# EAGLE design osso (EAGLE 6.5.0)
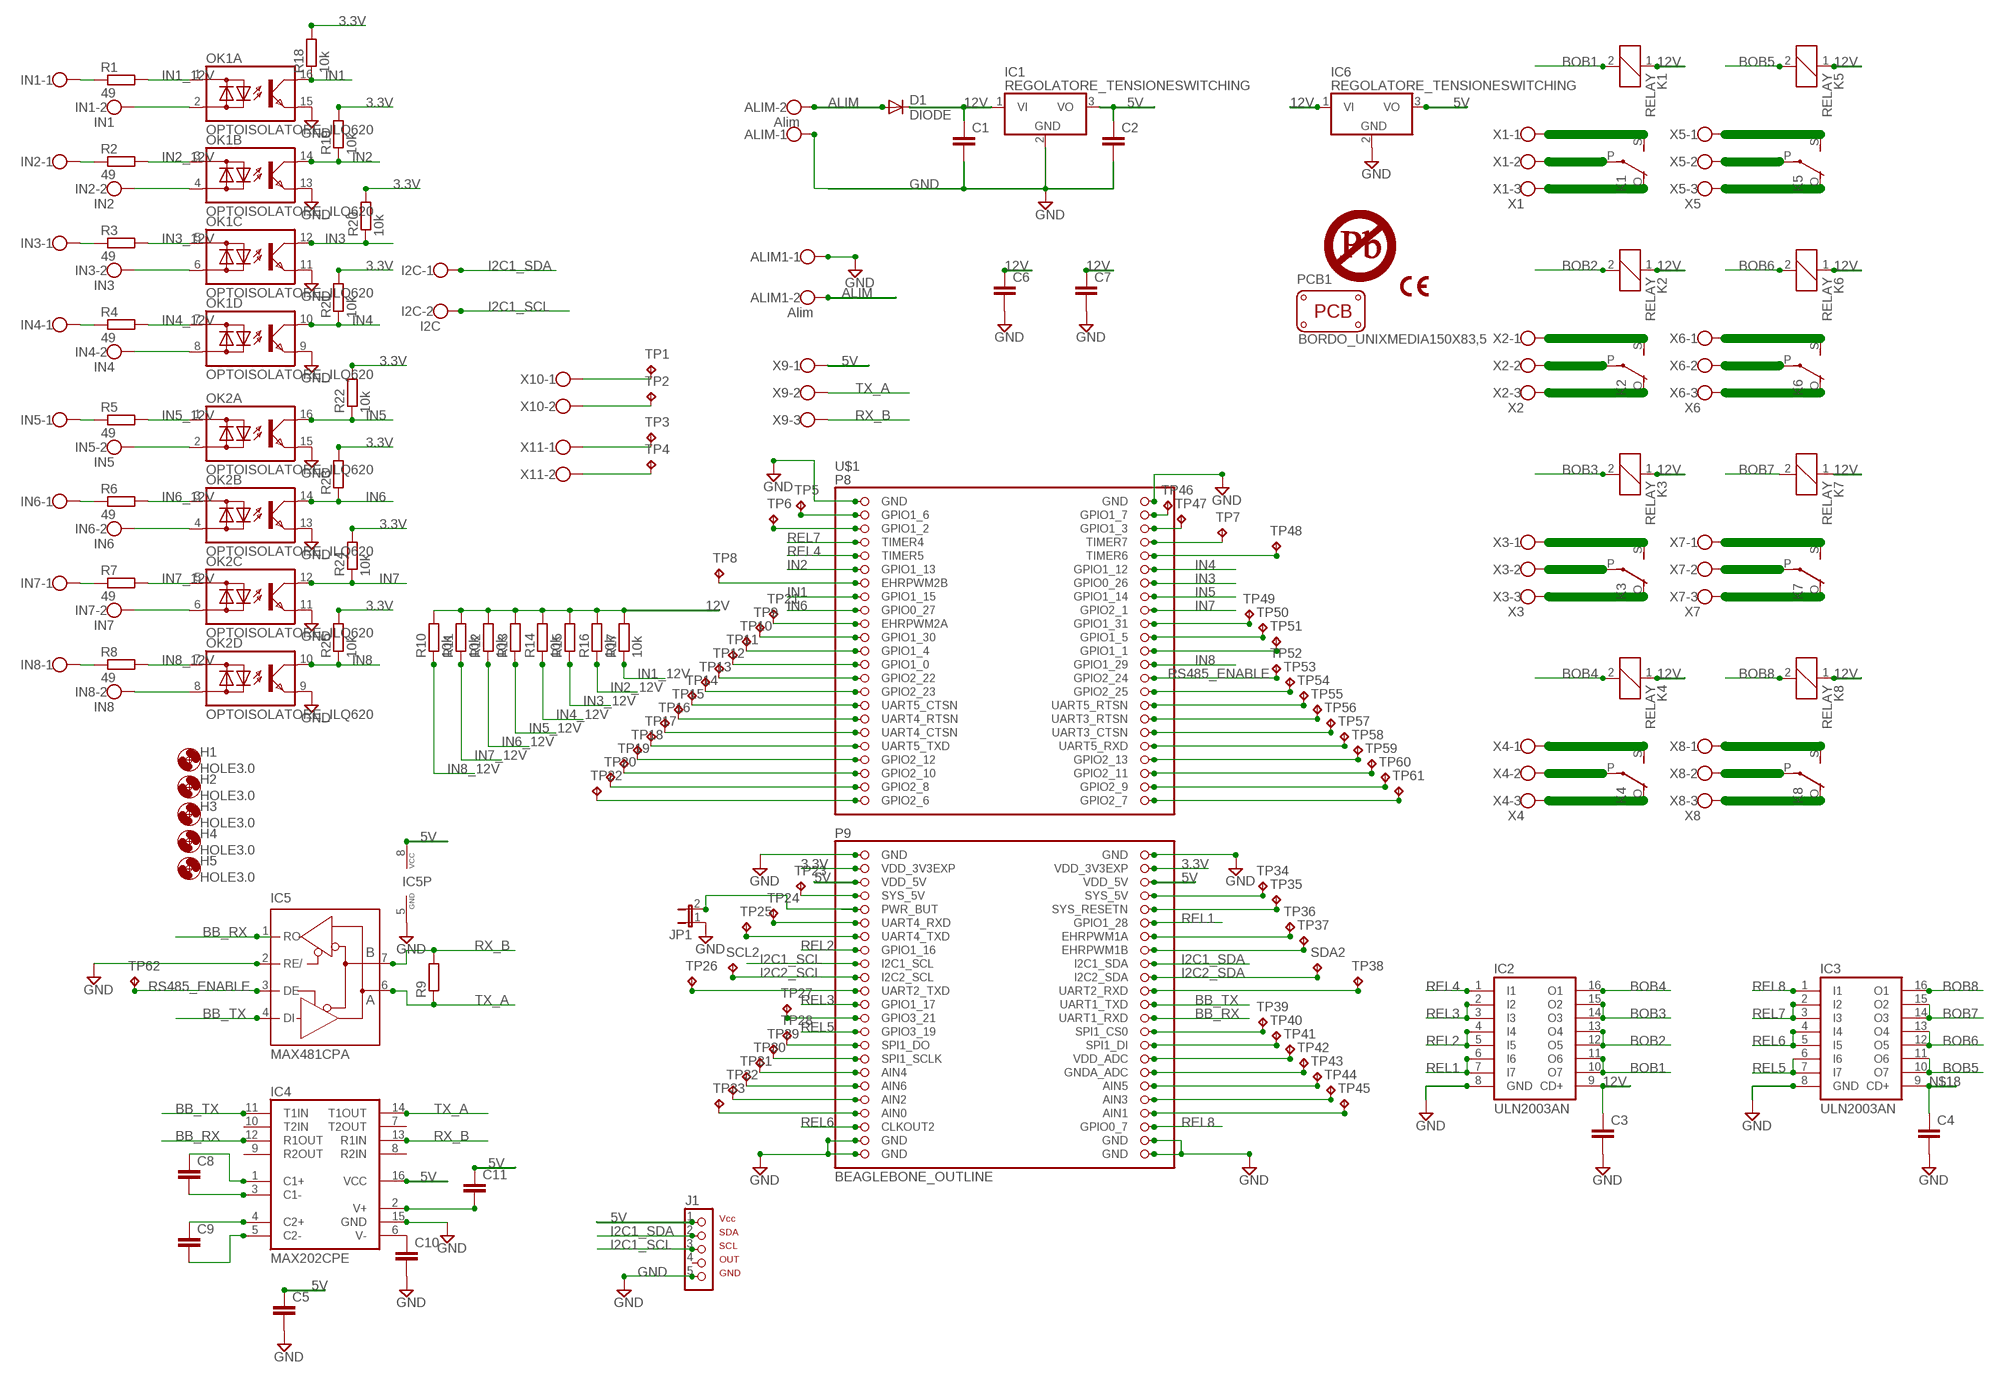
[diagram p0: schematic, sheet 1]

## Parts
ALIM  Alim  MORSETTO_2  [W237-102]
ALIM1  Alim  MORSETTO_2  [W237-102]
C1  C5/2.5  [C5B2.5]
C2  C5/2.5  [C5B2.5]
C3  C5/2.5  [C5B2.5]
C4  C5/2.5  [C5B2.5]
C5  C5/2.5  [C5B2.5]
C6  C5/2.5  [C5B2.5]
C7  C5/2.5  [C5B2.5]
C8  C5/2.5  [C5B2.5]
C9  C5/2.5  [C5B2.5]
C10  C5/2.5  [C5B2.5]
C11  C5/2.5  [C5B2.5]
D1  DIODE  [DO15-12]
H1  HOLE3.0  [3,0]
H2  HOLE3.0  [3,0]
H3  HOLE3.0  [3,0]
H4  HOLE3.0  [3,0]
H5  HOLE3.0  [3,0]
I2C  I2C  MORSETTO_2  [W237-102]
IC1  REGOLATORE_TENSIONESWITCHING  [MT6-3]
IC2  ULN2003AN  [DIL16]
IC3  ULN2003AN  [DIL16]
IC4  MAX202CPE  [DIL16]
IC5  MAX481CPA  [DIL08]
IC6  REGOLATORE_TENSIONESWITCHING  [MT6-3]
IN1  IN1  MORSETTO_2  [W237-102]
IN2  IN2  MORSETTO_2  [W237-102]
IN3  IN3  MORSETTO_2  [W237-102]
IN4  IN4  MORSETTO_2  [W237-102]
IN5  IN5  MORSETTO_2  [W237-102]
IN6  IN6  MORSETTO_2  [W237-102]
IN7  IN7  MORSETTO_2  [W237-102]
IN8  IN8  MORSETTO_2  [W237-102]
J1  RTC_MICROROBOT_ALGOZINO-PTH  [RTC_MICROBOT_ALGOZINO]
JP1  JUMPER_2  [JP1]
K1  RELAY  [G5LE]
K2  RELAY  [G5LE]
K3  RELAY  [G5LE]
K4  RELAY  [G5LE]
K5  RELAY  [G5LE]
K6  RELAY  [G5LE]
K7  RELAY  [G5LE]
K8  RELAY  [G5LE]
OK1  OPTOISOLATORE_ILQ620  [DIL16]
OK2  OPTOISOLATORE_ILQ620  [DIL16]
PCB1  BORDO_UNIXMEDIA150X83,5  [BORD_UNIXMEDIA]
R1  49  RESISTOR0204/7  [0204/7]
R2  49  RESISTOR0204/7  [0204/7]
R3  49  RESISTOR0204/7  [0204/7]
R4  49  RESISTOR0204/7  [0204/7]
R5  49  RESISTOR0204/7  [0204/7]
R6  49  RESISTOR0204/7  [0204/7]
R7  49  RESISTOR0204/7  [0204/7]
R8  49  RESISTOR0204/7  [0204/7]
R9  RESISTOR0204/7  [0204/7]
R10  10k  RESISTOR0204/7  [0204/7]
R11  10k  RESISTOR0204/7  [0204/7]
R12  10k  RESISTOR0204/7  [0204/7]
R13  RESISTOR0204/7  [0204/7]
R14  10k  RESISTOR0204/7  [0204/7]
R15  RESISTOR0204/7  [0204/7]
R16  10k  RESISTOR0204/7  [0204/7]
R17  10k  RESISTOR0204/7  [0204/7]
R18  10k  RESISTOR0204/7  [0204/7]
R19  10k  RESISTOR0204/7  [0204/7]
R20  10k  RESISTOR0204/7  [0204/7]
R21  10k  RESISTOR0204/7  [0204/7]
R22  10k  RESISTOR0204/7  [0204/7]
R23  RESISTOR0204/7  [0204/7]
R24  10k  RESISTOR0204/7  [0204/7]
R25  10k  RESISTOR0204/7  [0204/7]
SCL2  TPPAD1-13  [TEST_POINT]
SDA2  TP1  TPPAD1-13  [TEST_POINT]
SS1  CE-MARK  [CE-MARK-0.2]
SS2  PB-MARK  [PB-MARK-0.2]
TP1  TPPAD1-13  [TEST_POINT]
TP2  TPPAD1-13  [TEST_POINT]
TP3  TPPAD1-13  [TEST_POINT]
TP4  TPPAD1-13  [TEST_POINT]
TP5  TPPAD1-13  [TEST_POINT]
TP6  TPPAD1-13  [TEST_POINT]
TP7  TPPAD1-13  [TEST_POINT]
TP8  TPPAD1-13  [TEST_POINT]
TP9  TPPAD1-13  [TEST_POINT]
TP10  TPPAD1-13  [TEST_POINT]
TP11  TPPAD1-13  [TEST_POINT]
TP12  TPPAD1-13  [TEST_POINT]
TP13  TPPAD1-13  [TEST_POINT]
TP14  TPPAD1-13  [TEST_POINT]
TP15  TPPAD1-13  [TEST_POINT]
TP16  TPPAD1-13  [TEST_POINT]
TP17  TPPAD1-13  [TEST_POINT]
TP18  TPPAD1-13  [TEST_POINT]
TP19  TPPAD1-13  [TEST_POINT]
TP20  TPPAD1-13  [TEST_POINT]
TP21  TPPAD1-13  [TEST_POINT]
TP22  TPPAD1-13  [TEST_POINT]
TP23  TPPAD1-13  [TEST_POINT]
TP24  TPPAD1-13  [TEST_POINT]
TP25  TPPAD1-13  [TEST_POINT]
TP26  TPPAD1-13  [TEST_POINT]
TP27  TPPAD1-13  [TEST_POINT]
TP28  TPPAD1-13  [TEST_POINT]
TP29  TPPAD1-13  [TEST_POINT]
TP30  TPPAD1-13  [TEST_POINT]
TP31  TPPAD1-13  [TEST_POINT]
TP32  TPPAD1-13  [TEST_POINT]
TP33  TPPAD1-13  [TEST_POINT]
TP34  TPPAD1-13  [TEST_POINT]
TP35  TPPAD1-13  [TEST_POINT]
TP36  TPPAD1-13  [TEST_POINT]
TP37  TPPAD1-13  [TEST_POINT]
TP38  TPPAD1-13  [TEST_POINT]
TP39  TPPAD1-13  [TEST_POINT]
TP40  TPPAD1-13  [TEST_POINT]
TP41  TPPAD1-13  [TEST_POINT]
TP42  TPPAD1-13  [TEST_POINT]
TP43  TPPAD1-13  [TEST_POINT]
TP44  TPPAD1-13  [TEST_POINT]
TP45  TPPAD1-13  [TEST_POINT]
TP46  TPPAD1-13  [TEST_POINT]
TP47  TPPAD1-13  [TEST_POINT]
TP48  TPPAD1-13  [TEST_POINT]
TP49  TPPAD1-13  [TEST_POINT]
TP50  TPPAD1-13  [TEST_POINT]
TP51  TPPAD1-13  [TEST_POINT]
TP52  TPPAD1-13  [TEST_POINT]
TP53  TPPAD1-13  [TEST_POINT]
TP54  TPPAD1-13  [TEST_POINT]
TP55  TPPAD1-13  [TEST_POINT]
TP56  TPPAD1-13  [TEST_POINT]
TP57  TPPAD1-13  [TEST_POINT]
TP58  TPPAD1-13  [TEST_POINT]
TP59  TPPAD1-13  [TEST_POINT]
TP60  TPPAD1-13  [TEST_POINT]
TP61  TPPAD1-13  [TEST_POINT]
TP62  TPPAD1-13  [TEST_POINT]
U$1  BEAGLEBONE_OUTLINE  [BEAGLEBONE_SHIELD]
X1  X1  MORSETTO_3  [W237-103]
X2  X2  MORSETTO_3  [W237-103]
X3  X3  MORSETTO_3  [W237-103]
X4  X4  MORSETTO_3  [W237-103]
X5  X5  MORSETTO_3  [W237-103]
X6  X6  MORSETTO_3  [W237-103]
X7  X7  MORSETTO_3  [W237-103]
X8  X8  MORSETTO_3  [W237-103]
X9  MORSETTO_3  [W237-103]
X10  MORSETTO_2  [W237-102]
X11  MORSETTO_2  [W237-102]

## Nets
3.3V: R18.2 R19.2 R20.2 R21.2 R22.2 R23.2 R24.2 R25.2 U$1.49(VDD_3V3EXP) U$1.50(VDD_3V3EXP)
5V: C2.1 C5.1 C11.1 IC1.3(VO) IC4.16(VCC) IC5.8(VCC) IC6.3(VO) J1.1 U$1.51(VDD_5V) U$1.52(VDD_5V) X9.1
12V: C1.1 C3.1 C6.1 C7.1 D1.C IC1.1(VI) IC2.9(CD+) IC6.1(VI) K1.1 K2.1 K3.1 K4.1 K5.1 K6.1 K7.1 K8.1 R10.2 R11.2 R12.2 R13.2 R14.2 R15.2 R16.2 R17.2
ALIM: ALIM1.2 ALIM.2 D1.A
BB_RX: IC4.12(R1OUT) IC5.1(RO) U$1.72(UART1_RXD)
BB_TX: IC4.11(T1IN) IC5.4(DI) U$1.70(UART1_TXD)
BOB1: IC2.10(O7) IC2.11(O6) K1.2
BOB2: IC2.12(O5) IC2.13(O4) K2.2
BOB3: IC2.14(O3) IC2.15(O2) K3.2
BOB4: IC2.16(O1) K4.2
BOB5: IC3.10(O7) IC3.11(O6) K5.2
BOB6: IC3.12(O5) IC3.13(O4) K6.2
BOB7 [pista15]: IC3.14(O3) IC3.15(O2) K7.2
BOB8: IC3.16(O1) K8.2
GND: ALIM1.1 ALIM.1 C1.2 C2.2 C3.2 C4.2 C5.2 C6.2 C7.2 C10.2 IC1.2(GND) IC2.8(GND) IC3.8(GND) IC4.15(GND) IC5.2(RE/) IC5.5(GND) IC6.2(GND) J1.5 JP1.1 OK1.9(D:E) OK1.11(C:E) OK1.13(B:E) OK1.15(A:E) OK2.9(D:E) OK2.11(C:E) OK2.13(B:E) OK2.15(A:E) U$1.1(GND) U$1.2(GND) U$1.47(GND) U$1.48(GND) U$1.89(GND) U$1.90(GND) U$1.91(GND) U$1.92(GND)
I2C1_SCL: I2C.2 J1.3 U$1.63(I2C1_SCL)
I2C1_SDA: I2C.1 J1.2 U$1.64(I2C1_SDA)
I2C2_SCL: SCL2.TP U$1.65(I2C2_SCL)
I2C2_SDA: SDA2.TP U$1.66(I2C2_SDA)
IN1: OK1.16(A:C) R18.1 U$1.15(GPIO1_15)
IN1_12V: OK1.1(A:AC1) R1.2 R17.1
IN2: OK1.14(B:C) R19.1 U$1.11(GPIO1_13)
IN2_12V: OK1.3(B:AC1) R2.2 R16.1
IN3: OK1.12(C:C) R20.1 U$1.14(GPIO0_26)
IN3_12V: OK1.5(C:AC1) R3.2 R15.1
IN4: OK1.10(D:C) R21.1 U$1.12(GPIO1_12)
IN4_12V: OK1.7(D:AC1) R4.2 R14.1
IN5: OK2.16(A:C) R22.1 U$1.16(GPIO1_14)
IN5_12V: OK2.1(A:AC1) R5.2 R13.1
IN6: OK2.14(B:C) R23.1 U$1.17(GPIO0_27)
IN6_12V: OK2.3(B:AC1) R6.2 R12.1
IN7: OK2.12(C:C) R24.1 U$1.18(GPIO2_1)
IN7_12V: OK2.5(C:AC1) R7.2 R11.1
IN8: OK2.10(D:C) R25.1 U$1.26(GPIO1_29)
IN8_12V: OK2.7(D:AC1) R8.2 R10.1
N$1: IN1.1 R1.1
N$2: TP1.TP X10.1
N$6 [rele]: K5.S(2:S) X5.1
N$7 [rele]: K5.P(2:P) X5.2
N$8 [rele]: K5.O(2:O) X5.3
N$12 [rele]: K6.S(2:S) X6.1
N$13 [rele]: K6.P(2:P) X6.2
N$14 [rele]: K6.O(2:O) X6.3
N$15 [rele]: K3.S(2:S) X3.1
N$16 [rele]: K3.P(2:P) X3.2
N$17 [rele]: K3.O(2:O) X3.3
N$18: C4.1 IC3.9(CD+)
N$19 [rele]: K7.S(2:S) X7.1
N$20 [rele]: K7.P(2:P) X7.2
N$21 [rele]: K4.S(2:S) X4.1
N$22 [rele]: K4.P(2:P) X4.2
N$23 [rele]: K4.O(2:O) X4.3
N$24 [rele]: K8.S(2:S) X8.1
N$25 [rele]: K8.P(2:P) X8.2
N$26 [rele]: K8.O(2:O) X8.3
N$27: IN2.1 R2.1
N$28: TP2.TP X10.2
N$29: IN3.1 R3.1
N$30: TP3.TP X11.1
N$31: IN4.1 R4.1
N$32: TP4.TP X11.2
N$33: IN5.1 R5.1
N$34: TP7.TP U$1.8(TIMER7)
N$35: IN6.1 R6.1
N$36: TP22.TP U$1.45(GPIO2_6)
N$37: IN7.1 R7.1
N$38: TP20.TP U$1.43(GPIO2_8)
N$39: IN8.1 R8.1
N$40: TP19.TP U$1.41(GPIO2_10)
N$41: IN8.2 OK2.8(D:AC2)
N$42: IN7.2 OK2.6(C:AC2)
N$43: IN6.2 OK2.4(B:AC2)
N$44: IN5.2 OK2.2(A:AC2)
N$45: IN1.2 OK1.2(A:AC2)
N$46: IN2.2 OK1.4(B:AC2)
N$47: IN3.2 OK1.6(C:AC2)
N$48: IN4.2 OK1.8(D:AC2)
N$49: JP1.2 U$1.55(PWR_BUT)
N$50: TP18.TP U$1.39(GPIO2_12)
N$51: TP17.TP U$1.37(UART5_TXD)
N$52: TP16.TP U$1.35(UART4_CTSN)
N$53: TP15.TP U$1.33(UART4_RTSN)
N$54: TP14.TP U$1.31(UART5_CTSN)
N$55: TP13.TP U$1.29(GPIO2_23)
N$56: TP12.TP U$1.27(GPIO2_22)
N$57: TP11.TP U$1.25(GPIO1_0)
N$58: TP10.TP U$1.23(GPIO1_4)
N$59: TP9.TP U$1.21(GPIO1_30)
N$60: TP21.TP U$1.19(EHRPWM2A)
N$61: TP5.TP U$1.3(GPIO1_6)
N$62: TP6.TP U$1.5(GPIO1_2)
N$63 [rele]: K7.O(2:O) X7.3
N$64: TP8.TP U$1.13(EHRPWM2B)
N$65: TP33.TP U$1.85(AIN0)
N$66: TP32.TP U$1.83(AIN2)
N$67: TP31.TP U$1.81(AIN6)
N$68: TP30.TP U$1.79(AIN4)
N$69: TP29.TP U$1.77(SPI1_SCLK)
N$70: TP28.TP U$1.75(SPI1_DO)
N$71: TP27.TP U$1.71(GPIO3_21)
N$72: TP26.TP U$1.67(UART2_TXD)
N$73: TP25.TP U$1.59(UART4_TXD)
N$74: TP24.TP U$1.57(UART4_RXD)
N$75: TP23.TP U$1.53(SYS_5V)
N$76: TP34.TP U$1.54(SYS_5V)
N$77: TP35.TP U$1.56(SYS_RESETN)
N$78: TP36.TP U$1.60(EHRPWM1A)
N$79: TP37.TP U$1.62(EHRPWM1B)
N$80: TP38.TP U$1.68(UART2_RXD)
N$81: TP39.TP U$1.74(SPI1_CS0)
N$82: TP40.TP U$1.76(SPI1_DI)
N$83: TP41.TP U$1.78(VDD_ADC)
N$84: TP42.TP U$1.80(GNDA_ADC)
N$85: TP43.TP U$1.82(AIN5)
N$86: TP44.TP U$1.84(AIN3)
N$87: TP45.TP U$1.86(AIN1)
N$88: TP61.TP U$1.46(GPIO2_7)
N$89: TP60.TP U$1.44(GPIO2_9)
N$90: TP59.TP U$1.42(GPIO2_11)
N$91: TP58.TP U$1.40(GPIO2_13)
N$92: TP57.TP U$1.38(UART5_RXD)
N$93: TP56.TP U$1.36(UART3_CTSN)
N$94: TP55.TP U$1.34(UART3_RTSN)
N$95: TP54.TP U$1.32(UART5_RTSN)
N$96: TP53.TP U$1.30(GPIO2_25)
N$98: TP51.TP U$1.24(GPIO1_1)
N$99: TP50.TP U$1.22(GPIO1_5)
N$100: TP49.TP U$1.20(GPIO1_31)
N$101: TP48.TP U$1.10(TIMER6)
N$102: TP47.TP U$1.6(GPIO1_3)
N$103: TP46.TP U$1.4(GPIO1_7)
N$105: C8.1 IC4.1(C1+)
N$106: C8.2 IC4.3(C1-)
N$107: C9.1 IC4.4(C2+)
N$108: C9.2 IC4.5(C2-)
R1_C [rele]: K1.P(2:P) X1.2
R1_NA [rele]: K1.S(2:S) X1.1
R1_NC [rele]: K1.O(2:O) X1.3
R2_C [rele]: K2.P(2:P) X2.2
R2_NA [rele]: K2.S(2:S) X2.1
R2_NC [rele]: K2.O(2:O) X2.3
REL1: IC2.6(I6) IC2.7(I7) U$1.58(GPIO1_28)
REL2: IC2.4(I4) IC2.5(I5) U$1.61(GPIO1_16)
REL3: IC2.2(I2) IC2.3(I3) U$1.69(GPIO1_17)
REL4: IC2.1(I1) U$1.9(TIMER5)
REL5: IC3.6(I6) IC3.7(I7) U$1.73(GPIO3_19)
REL6: IC3.4(I4) IC3.5(I5) U$1.87(CLKOUT2)
REL7: IC3.2(I2) IC3.3(I3) U$1.7(TIMER4)
REL8: IC3.1(I1) U$1.88(GPIO0_7)
RS485_ENABLE: IC5.3(DE) TP52.TP TP62.TP U$1.28(GPIO2_24)
RX_B: IC4.13(R1IN) IC5.7(B) R9.2 X9.3
TX_A: IC4.14(T1OUT) IC5.6(A) R9.1 X9.2
V+: C11.2 IC4.2(V+)
V-: C10.1 IC4.6(V-)
Unconnected: IC4.7(T2OUT) IC4.8(R2IN) IC4.9(R2OUT) IC4.10(T2IN) J1.4

## Library data of the parts
ALIM ALIM1 I2C IN1-IN8 X10 X11 = 0_My_Library:MORSETTO_2: WAGO SCREW CLAMP; MPN: 237-102; OC_FARNELL: unknown; OC_NEWARK: 70K9898
C1-C11 = My_Library:C: CAPACITOR naming: grid - package width
D1 = My_Library:DIODE: DIODE controlled avalanche rectifier
H1-H5 = 0_My_Library:HOLE: MOUNTING HOLE with drill center marker
IC1 IC6 = My_Library:REGOLATORE_TENSIONE: Positive VOLTAGE REGULATOR Source: http://cache.national.com/ds/LM/LM78L05.pdf http://www.fairchildsemi.com/ds/LM/LM7805.pdf
IC2 IC3 = My_Library:ULN2003A: DRIVER ARRAY
IC4 = maxim:MAX202CPE: RS232 TRANSEIVER; MF: MAXIM; MPN: MAX202CPE+; OC_FARNELL: 9723803; OC_NEWARK: 68K4531
IC5 = maxim:MAX481CPA: RS485 TRANSEIVER; MPN: MAX481CPA+; OC_FARNELL: unknown; OC_NEWARK: 99K3445
J1 = 0_My_Library:RTC_MICROROBOT_ALGOZINO
JP1 = 0_My_Library:JUMPER_2: JUMPER
K1-K6 K8 = My_Library:RELAY: RELAY 1 x switch, 10 A/120 V AC, 8 A/30 V ADC, Omron; OC_FARNELL: unknown; OC_NEWARK: unknown
K7 = 0_My_Library:RELAY: RELAY 1 x switch, 10 A/120 V AC, 8 A/30 V ADC, Omron; OC_FARNELL: unknown; OC_NEWARK: unknown
OK1 OK2 = 0_My_Library:OPTOISOLATORE_ILQ620: SIEMENS OPTO COUPLER; MF: VISHAY/TELEFUNKEN; MPN: ILQ620; OC_FARNELL: 1612470; OC_NEWARK: 58K1694
PCB1 = 0_My_Library:BORDO_UNIXMEDIA: Dangerous Prototypes Standard Rectangular PCB sizes
R1-R25 = 0_My_Library:RESISTOR: RESISTOR, European symbol
SCL2 SDA2 TP1-TP62 = 0_My_Library:TP: Test pad
SS1 = 0_My_Library:CE-MARK
SS2 = 0_My_Library:PB-MARK
U$1 = adafruit:BEAGLEBONE_OUTLINE: Should match A3 pinout - but not completely tested
X1-X9 = 0_My_Library:MORSETTO_3: WAGO SCREW CLAMP; MPN: 237-103; OC_FARNELL: unknown; OC_NEWARK: 18M7116

## Net classes
0 default: width 0.254 mm
1 rele: width 1.676 mm
2 pista15: width 0.381 mm

## Board
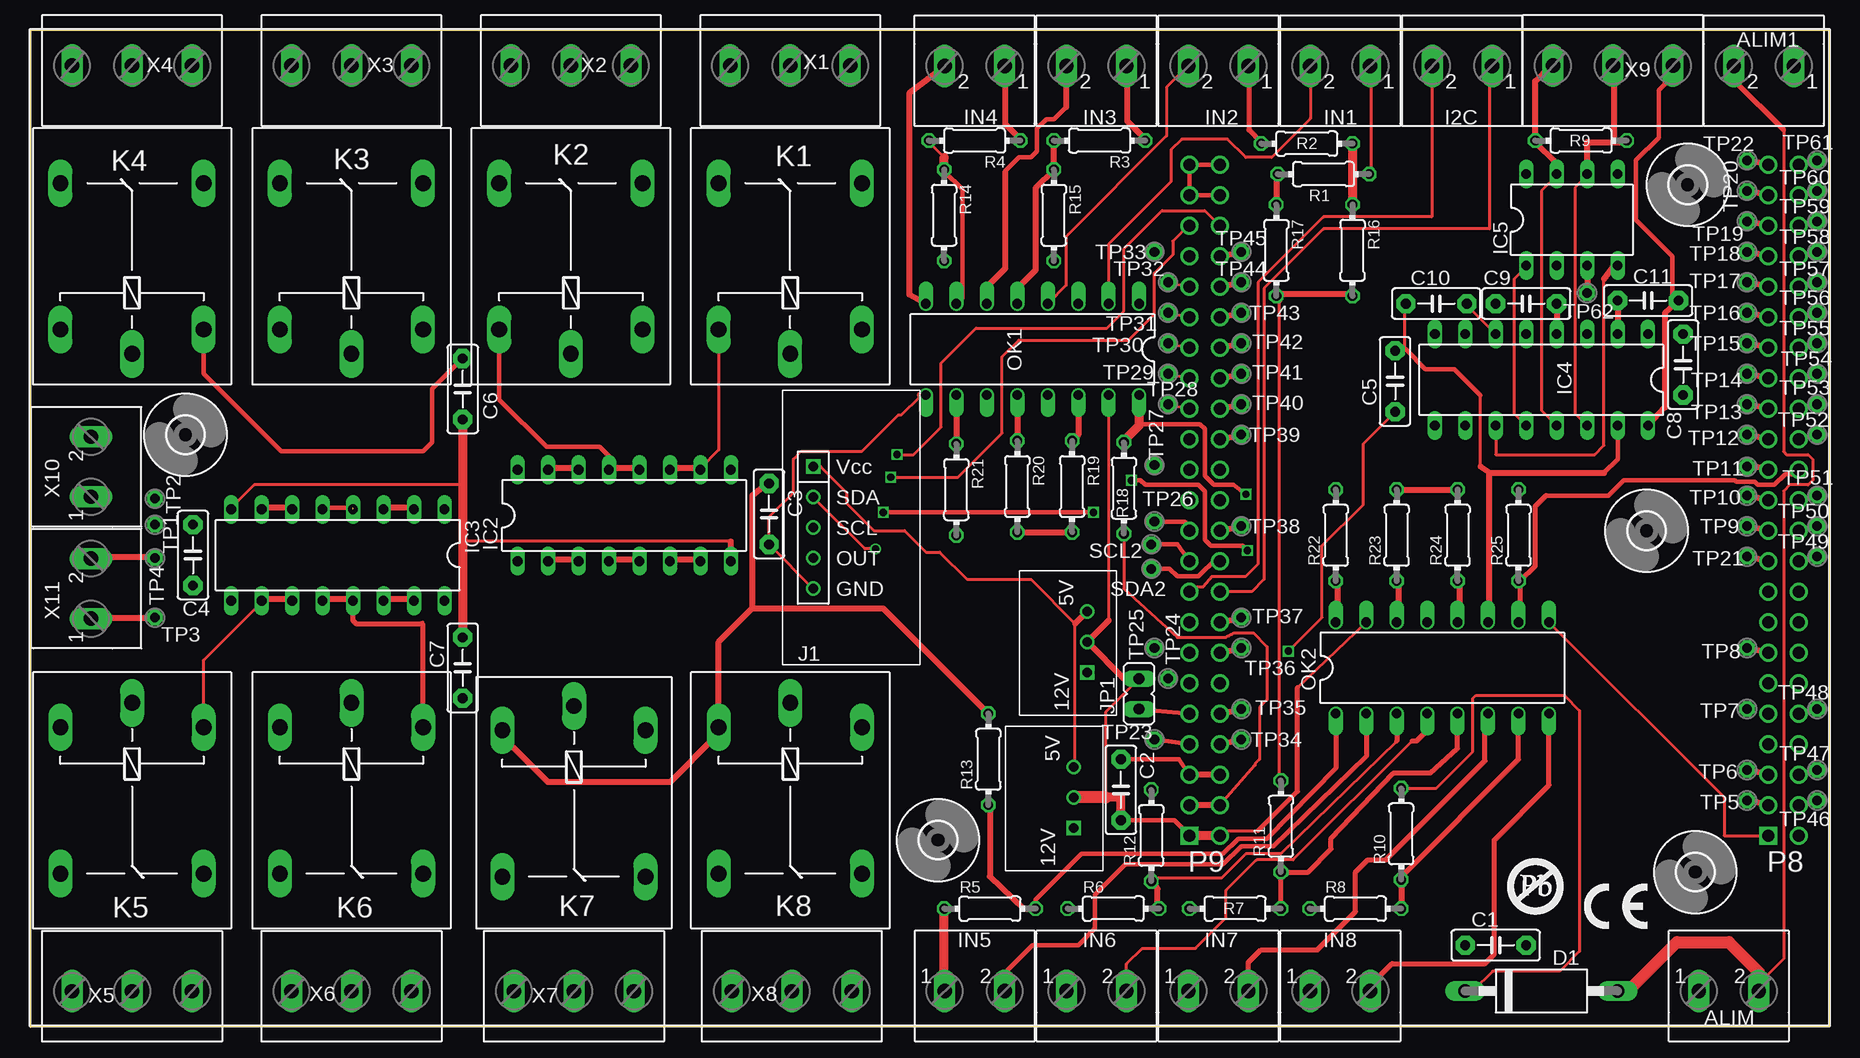
[diagram p1: board, top side]
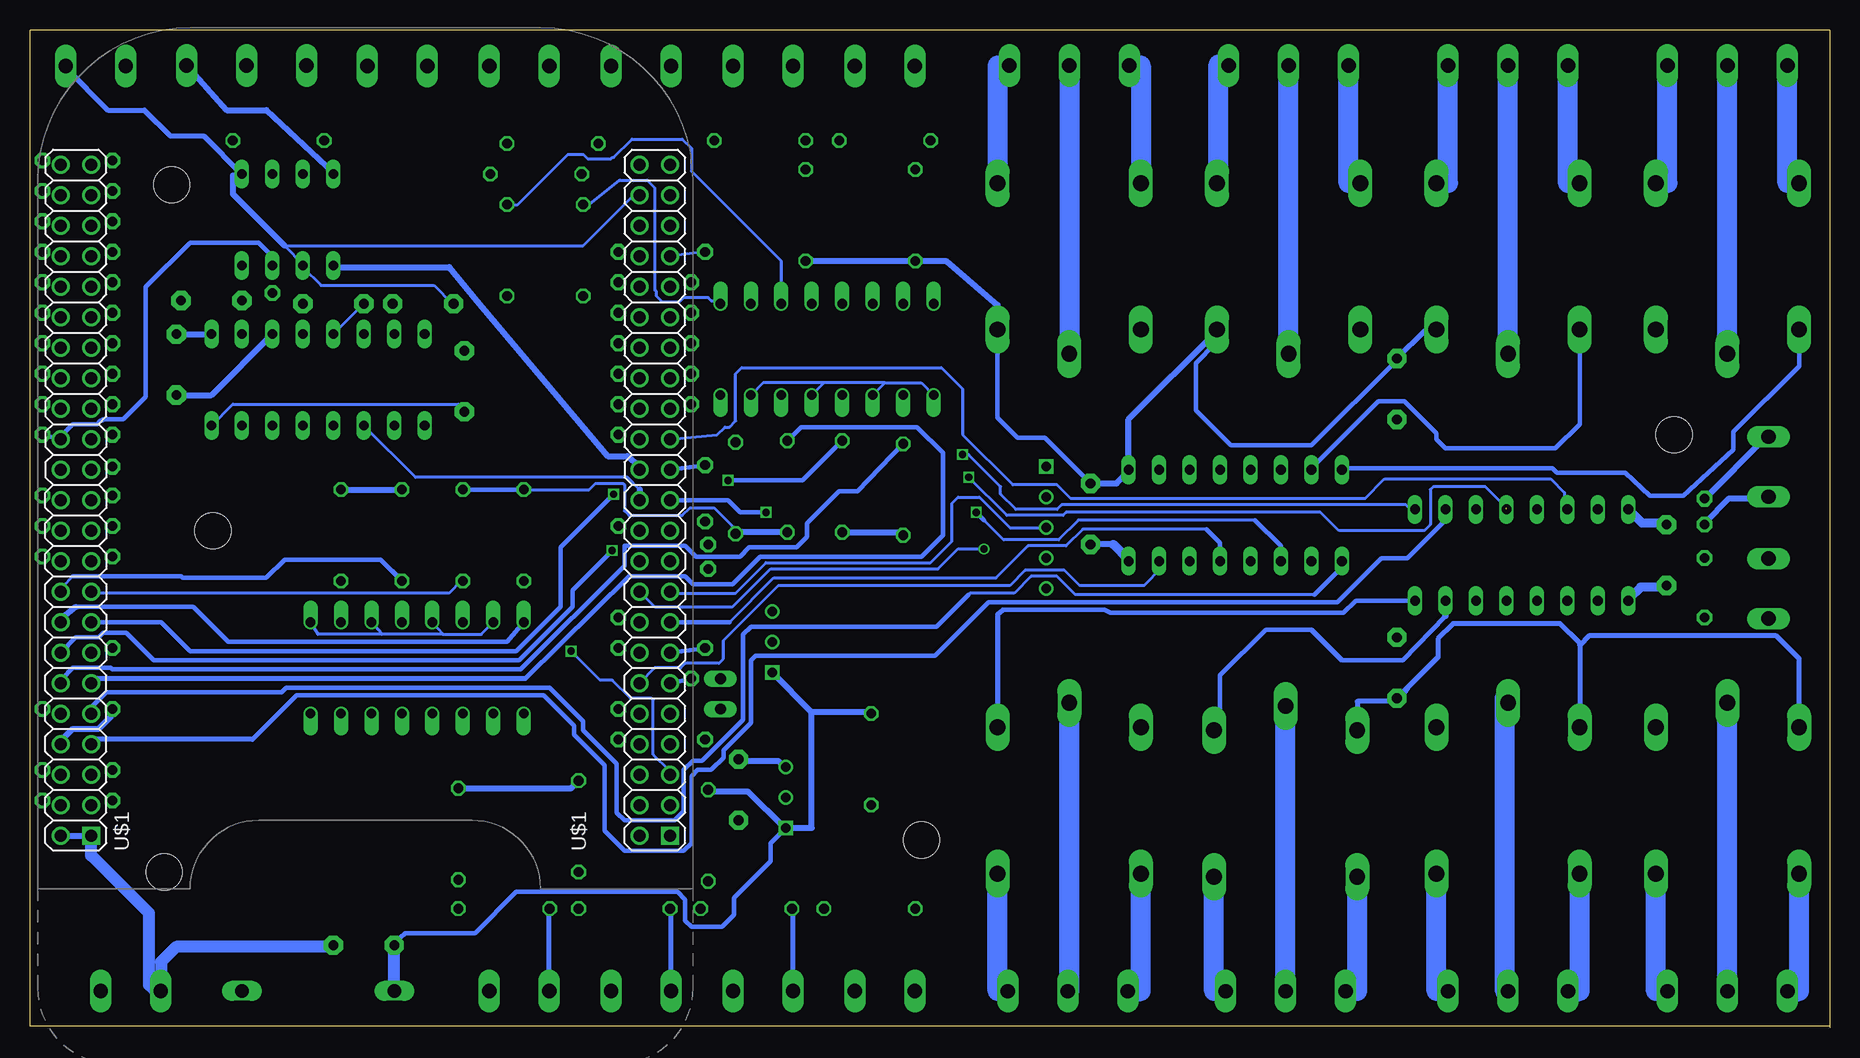
[diagram p2: board, bottom side, seen from below]

Size 150 x 83.13 mm. Coordinates in mm from the lower left corner, seen from the top.
Copper layers (1*2*15*16): Top 0.035mm / dielectric 0.2mm / Route2 0.0175mm / dielectric 1.1mm / Route15 0.0175mm / dielectric 0.2mm / Bottom 0.035mm
Design rules "default": minimum track width 6mil, minimum drill 12mil, track to track 6mil, track to pad 6mil, pad to pad 6mil, via to via 6mil, smd to smd 0mil, copper to edge 10mil, drill to drill 10mil, minimum pad ring 6mil, minimum via ring 6mil, stop-mask expansion 2mil, vias tented up to drill 25mil, thermal gap 10mil

### Footprints (pad centres in the part's own frame; a part is rotated, then mirrored left to right if it is on the bottom)
W237-102 = drill 1.194 long: 1 -2.5,-1.27; 2 2.5,-1.27
C5B2.5 = drill 0.813 pad 1.6 octagon: 1 -2.54,0; 2 2.54,0
DO15-12 = drill 1.118 long: A 6.35,0; C -6.35,0
3,0 = hole 3: 0,0
MT6-3 = drill 0.8 square: 1 5.08,0.508 | drill 0.8: 2 2.54,0.508; 3 0,0.508
DIL16 = drill 0.813 long: 1 -8.89,-3.81; 2 -6.35,-3.81; 3 -3.81,-3.81; 4 -1.27,-3.81; 5 1.27,-3.81; 6 3.81,-3.81; 7 6.35,-3.81; 8 8.89,-3.81; 9 8.89,3.81; 10 6.35,3.81; 11 3.81,3.81; 12 1.27,3.81; 13 -1.27,3.81; 14 -3.81,3.81; 15 -6.35,3.81; 16 -8.89,3.81
DIL08 = drill 0.813 long: 1 -3.81,-3.81; 2 -1.27,-3.81; 3 1.27,-3.81; 4 3.81,-3.81; 5 3.81,3.81; 6 1.27,3.81; 7 -1.27,3.81; 8 -3.81,3.81
RTC_MICROBOT_ALGOZINO = drill 0.8 square: 1 -5.08,0 | drill 0.8: 2 -2.54,0; 3 0,0; 4 2.54,0; 5 5.08,0
JP1 = drill 0.914 long: 1 0,-1.27; 2 0,1.27
G5LE = drill 1.321 long: 1 -7.493,-5.969; 2 -7.493,5.969; O 4.699,5.969; P -9.525,0; S 4.699,-5.969
DIL16' = drill 0.813 offset: 1 -8.89,-3.81; 2 -6.35,-3.81; 3 -3.81,-3.81; 4 -1.27,-3.81; 5 1.27,-3.81; 6 3.81,-3.81; 7 6.35,-3.81; 8 8.89,-3.81; 9 8.89,3.81; 10 6.35,3.81; 11 3.81,3.81; 12 1.27,3.81; 13 -1.27,3.81; 14 -3.81,3.81; 15 -6.35,3.81; 16 -8.89,3.81
0204/7 = drill 0.813 octagon: 1 -3.81,0; 2 3.81,0
TEST_POINT = drill 0.8 pad 1.308 octagon: TP 0,0
BEAGLEBONE_SHIELD = drill 1 square: 1 4.445,19.05; 47 52.705,19.05 | drill 1: 2 1.905,19.05; 3 4.445,21.59; 4 1.905,21.59; 5 4.445,24.13; 6 1.905,24.13; 7 4.445,26.67; 8 1.905,26.67; 9 4.445,29.21; 10 1.905,29.21; 11 4.445,31.75; 12 1.905,31.75; 13 4.445,34.29; 14 1.905,34.29; 15 4.445,36.83; 16 1.905,36.83; 17 4.445,39.37; 18 1.905,39.37; 19 4.445,41.91; 20 1.905,41.91; 21 4.445,44.45; 22 1.905,44.45; 23 4.445,46.99; 24 1.905,46.99; 25 4.445,49.53; 26 1.905,49.53; 27 4.445,52.07; 28 1.905,52.07; 29 4.445,54.61; 30 1.905,54.61; 31 4.445,57.15; 32 1.905,57.15; 33 4.445,59.69; 34 1.905,59.69; 35 4.445,62.23; 36 1.905,62.23; 37 4.445,64.77; 38 1.905,64.77; 39 4.445,67.31; 40 1.905,67.31; 41 4.445,69.85; 42 1.905,69.85; 43 4.445,72.39; 44 1.905,72.39; 45 4.445,74.93; 46 1.905,74.93; 48 50.165,19.05; 49 52.705,21.59; 50 50.165,21.59; 51 52.705,24.13; 52 50.165,24.13; 53 52.705,26.67; 54 50.165,26.67; 55 52.705,29.21; 56 50.165,29.21; 57 52.705,31.75; 58 50.165,31.75; 59 52.705,34.29; 60 50.165,34.29; 61 52.705,36.83; 62 50.165,36.83; 63 52.705,39.37; 64 50.165,39.37; 65 52.705,41.91; 66 50.165,41.91; 67 52.705,44.45; 68 50.165,44.45; 69 52.705,46.99; 70 50.165,46.99; 71 52.705,49.53; 72 50.165,49.53; 73 52.705,52.07; 74 50.165,52.07; 75 52.705,54.61; 76 50.165,54.61; 77 52.705,57.15; 78 50.165,57.15; 79 52.705,59.69; 80 50.165,59.69; 81 52.705,62.23; 82 50.165,62.23; 83 52.705,64.77; 84 50.165,64.77; 85 52.705,67.31; 86 50.165,67.31; 87 52.705,69.85; 88 50.165,69.85; 89 52.705,72.39; 90 50.165,72.39; 91 52.705,74.93; 92 50.165,74.93
W237-103 = drill 1.194 long: 1 -5,-1.29; 2 0,-1.29; 3 5,-1.29

### Placement (x,y rotation side)
ALIM  141.6,4.32 0 top
ALIM1  144.53,78.87 180 top
C1  122.17,6.86 0 top
C2  90.93,19.81 270 top
C3  61.59,42.8 270 top
C4  13.59,39.37 90 top
C5  113.79,53.85 90 top
C6  36.07,53.21 270 top
C7  36.07,29.97 90 top
C8  137.79,55.25 270 top
C9  124.71,60.33 180 top
C10  117.22,60.33 180 top
C11  134.87,60.58 180 top
D1  125.98,3.05 0 top
H1  138.81,12.95 0 top
H2  12.95,49.4 0 top
H3  138.18,70.23 0 top
H4  75.69,15.62 0 top
H5  134.75,41.4 0 top
I2C  119.38,78.87 180 top
IC1  86.49,21.72 270 top
IC2  49.53,42.67 0 top
IC3  25.65,39.37 180 top
IC4  125.98,53.98 180 top
IC5  128.52,67.31 0 top
IC6  87.63,34.67 270 top
IN1  109.22,78.87 180 top
IN2  99.06,78.87 180 top
IN3  88.9,78.87 180 top
IN4  78.74,78.87 180 top
IN5  78.74,4.32 0 top
IN6  88.9,4.32 0 top
IN7  99.06,4.32 0 top
IN8  109.22,4.32 0 top
J1  65.28,41.66 270 top
JP1  92.46,27.81 180 top
K1  63.37,65.66 90 top
K2  45.09,65.66 90 top
K3  26.8,65.66 90 top
K4  8.51,65.66 90 top
K5  8.51,17.53 270 top
K6  26.8,17.53 270 top
K7  45.34,17.27 270 top
K8  63.37,17.53 270 top
OK1  OPTOISOLATORE_ILQ620  [DIL16']  83.57,56.52 180 top
OK2  OPTOISOLATORE_ILQ620  [DIL16']  117.73,29.97 0 top
PCB1  0,0.13 0 top
R1  107.82,71.12 180 top
R2  106.43,73.66 0 top
R3  89.15,73.91 180 top
R4  78.74,73.91 180 top
R5  80.01,9.91 0 top
R6  90.3,9.91 0 top
R7  100.46,9.91 0 top
R8  110.49,9.91 0 top
R9  129.29,73.91 180 top
R10  114.3,16.13 90 top
R11  104.27,16.76 90 top
R12  93.47,16 90 top
R13  79.88,22.35 90 top
R14  76.2,67.69 270 top
R15  85.34,67.69 270 top
R16  110.24,64.77 270 top
R17  103.89,64.77 270 top
R18  91.19,44.96 270 top
R19  86.87,45.09 270 top
R20  82.3,45.09 270 top
R21  77.22,44.83 270 top
R22  108.84,41.02 90 top
R23  113.92,41.02 90 top
R24  119,41.02 90 top
R25  124.08,41.02 90 top
SCL2  93.47,40.26 0 top
SDA2  93.47,38.23 0 top
SS1  129.29,8 0 top
SS2  123.06,9.27 0 top
TP1  10.41,41.91 0 top
TP2  10.41,44.07 0 top
TP3  10.41,34.16 0 top
TP4  10.41,39.12 0 top
TP5  143.13,18.92 0 top
TP6  143.13,21.46 0 top
TP7  143.13,26.54 0 top
TP8  143.13,31.62 0 top
TP9  143.13,41.78 0 top
TP10  143.13,44.32 0 top
TP11  143.13,46.74 0 top
TP12  143.13,49.4 0 top
TP13  143.13,51.94 0 top
TP14  143.13,54.48 0 top
TP15  143.13,57.02 0 top
TP16  143.13,59.56 0 top
TP17  143.13,62.1 0 top
TP18  143.13,64.64 0 top
TP19  143.13,67.18 0 top
TP20  143.13,69.72 0 top
TP21  143.13,39.24 0 top
TP22  143.13,72.26 0 top
TP23  93.73,24 0 top
TP24  94.87,29.08 0 top
TP25  93.73,31.62 0 top
TP26  93.73,42.16 0 top
TP27  93.73,46.86 0 top
TP28  94.87,51.94 0 top
TP29  94.87,54.48 0 top
TP30  94.87,57.02 0 top
TP31  94.87,59.56 0 top
TP32  94.87,62.1 0 top
TP33  93.73,64.64 0 top
TP34  100.97,24 0 top
TP35  100.97,26.54 0 top
TP36  100.97,31.62 0 top
TP37  100.97,34.16 0 top
TP38  100.97,41.78 0 top
TP39  100.97,49.4 0 top
TP40  100.97,51.94 0 top
TP41  100.97,54.48 0 top
TP42  100.97,57.02 0 top
TP43  100.97,59.56 0 top
TP44  100.97,62.1 0 top
TP45  100.97,64.64 0 top
TP46  148.97,18.92 0 top
TP47  148.97,21.46 0 top
TP48  148.97,26.54 0 top
TP49  148.97,39.24 0 top
TP50  148.97,41.78 0 top
TP51  148.97,44.32 0 top
TP52  148.97,49.4 0 top
TP53  148.97,51.94 0 top
TP54  148.97,54.48 0 top
TP55  148.97,57.02 0 top
TP56  148.97,59.56 0 top
TP57  148.97,62.1 0 top
TP58  148.97,64.64 0 top
TP59  148.97,67.18 0 top
TP60  148.97,69.72 0 top
TP61  148.97,72.26 0 top
TP62  129.79,61.21 0 top
U$1  149.35,-3.05 0 bottom
X1  63.37,78.87 180 top
X2  45.09,78.87 180 top
X3  26.8,78.87 180 top
X4  8.51,78.87 180 top
X5  8.51,4.32 0 top
X6  26.8,4.32 0 top
X7  45.34,4.32 0 top
X8  63.5,4.32 0 top
X9  131.95,78.87 180 top
X10  3.81,46.74 90 top
X11  3.81,36.58 90 top

### Tracks (layer width: path | path; a pad name or v marks a point on that pad's centre or on a via)
3.3V
  Top 0.254: R18.2 91.19,36.58 95.63,32.51 99.69,32.51 99.82,32.64 99.95,32.64 100.08,32.77 100.2,32.77 100.33,32.89 101.98,32.89 103.12,31.75 103.12,27.31 102.49,26.67 102.49,22.35 102.11,21.97 102.11,21.84 U$1.50
  Top 0.508: R20.2 R19.2 | U$1.50 U$1.49 | R23.2 R24.2
  Bottom 0.152: 91.19,41.28 R18.2
  Bottom 0.254: R22.2 103.38,44.83 102.87,45.34 100.58,45.34 100.46,45.21 100.46,43.05 100.08,42.67 95.63,42.67 95,43.31 92.96,43.31 91.44,41.78 91.44,41.4 R18.2
  Bottom 0.381: R23.2 R22.2
  Bottom 0.508: R19.2 91.19,41.28 | R21.2 77.47,41.28 R20.2 | R25.2 R24.2
5V  (via drill 0.6)
  Top 0.152: 87.12,21.72 IC1.3 | 136.91,80.14 X9.1
  Top 0.254: 87.12,21.72 87.12,33.66 83.44,37.34 78.11,37.34 75.82,39.62 74.68,39.62 72.9,41.4 70.36,41.4 68.07,43.69 68.07,44.58 65.91,46.74 J1.1 | C11.1 136.91,61.09 | v104.9,31.37 107.7,34.16 107.7,40.13 111.12,43.56 111.12,48.64 C5.1
  Top 0.381: C2.1 95.76,22.35 U$1.51 | 136.91,61.09 136.91,64.26 133.86,67.31 133.86,72.26 135.76,74.17 135.76,78.11 136.27,78.61 136.27,79.46 136.53,79.72 136.53,79.73 X9.1
  Top 0.508: 87.12,33.66 IC6.3 | U$1.52 U$1.51 | IC4.16 136.27,51.69 136.27,59.56 C11.1
  Bottom 0.152: 87.12,21.72 IC1.3 | 90.93,22.23 C2.1 | 114.3,51.94 113.79,51.44 C5.1 113.79,51.18 | 96.77,21.46 U$1.51
  Bottom 0.254: 114.3,51.94 133.1,51.94 IC4.16 | 96.77,21.46 98.04,22.73 98.04,27.31 98.17,27.43 99.95,27.43 101.47,28.96 102.49,28.96 v104.9,31.37
  Bottom 0.508: 87.12,21.72 87.63,22.23 90.93,22.23 | 136.91,80.14 133.6,76.45 130.3,76.45 124.71,71.25 IC5.8
  Bottom 0.762: 136.91,80.14 X9.1
12V
  Top 0.152: 103.89,61.09 R17.2 103.89,60.83 | 110.24,61.09 R16.2 | 104.14,20.7 R11.2
  Top 0.254: 104.14,20.7 104.14,60.58 | R10.2 117.22,19.94 120.27,22.99 120.27,27.43 120.52,27.69 127.89,27.69 129.16,26.42 129.16,6.35 127.51,4.7 121.92,4.7 120.27,3.05 D1.C
  Top 0.381: K4.1 14.48,54.48 20.95,48.01 32.77,48.01 33.53,48.77 33.53,53.21 C6.1
  Top 0.508: 60.2,34.93 60.2,44.32 61.47,45.34 C3.1 | 60.2,34.93 71.12,34.93 R13.2 | 110.24,61.09 103.89,61.09 | 104.14,60.58 103.89,60.83 | K7.1 39.37,24.26 43.18,20.45 53.34,20.45 57.15,24.26 K8.1 57.4,32.13 60.2,34.93
  Bottom 0.152: 80.01,26.29 R13.2 | 119.63,6.99 C1.1 | 87.12,16.64 IC1.1 | 20.83,25.15 K6.1 | 34.29,29.34 35.81,27.18 36.07,27.56 C7.1 | 33.78,58.04 32.77,58.04 K3.1 | 58.42,46.36 IC2.9 | 51.05,58.04 K2.1 | 69.34,58.04 K1.1
  Bottom 0.254: 119.13,7.49 119.63,6.99
  Bottom 0.381: C6.1 36.07,55.63 43.18,48.51 49.91,48.51 52.83,51.44 52.83,55.37 51.18,57.02 51.18,58.04 K2.1 | 69.34,58.04 69.34,50.8 67.69,49.15 65.41,49.15 C3.1 | IC1.1 88.27,15.37 88.27,13.84 91.31,10.8 91.31,9.4 92.33,8.38 94.87,8.38 95.38,8.89 95.38,10.67 96.01,11.3 109.47,11.3 112.9,7.87 118.75,7.87 119.13,7.49
  Bottom 0.406: 33.78,58.04 C6.1 | K7.1 39.37,27.18 35.81,27.18 | K5.1 2.54,30.73 4.45,32.64 20.07,32.64 20.83,31.88 | 20.83,31.88 20.83,25.15 20.95,25.02 20.95,25.27 | 20.95,25.27 20.95,25.78 21.08,25.91 21.08,25.4 20.95,25.27 | 20.83,31.88 20.83,32 22.48,33.66 31.37,33.66 32.64,32.39 32.64,30.86 C7.1
  Bottom 0.508: 84.84,26.29 IC6.1 | 80.01,26.29 84.84,26.29 | 87.12,16.64 90.17,19.69 93.47,19.69 R12.2 | 84.84,26.29 84.84,16.64 IC1.1 | R15.2 R14.2 73.66,63.88 69.34,60.2 K1.1 | 58.42,46.36 59.44,45.34 C3.1 | 51.05,58.04 58.42,50.67 IC2.9 | R11.2 104.9,19.94 R10.2
  Bottom 1.016: D1.C C1.1
ALIM
  Top 0.254: 146.18,74.8 146.18,48.01 146.43,47.75 148.21,47.75 148.59,47.37 148.59,45.59 148.21,45.21 146.69,45.21 146.18,44.7 146.18,5.72 144.15,3.68
  Top 0.406: ALIM1.2 142.03,78.95 146.18,74.8
  Top 1.016: D1.A 133.22,3.05 137.29,7.11 141.6,7.11 144.15,4.57 144.15,3.68 144.15,3.09 ALIM.2
BB_RX
  Top 0.152: 124.71,63.37 IC5.1
  Top 0.254: IC4.12 123.7,51.18 123.7,62.36 124.71,63.37
  Bottom 0.152: 99.31,46.86 U$1.72
  Bottom 0.508: 99.31,46.86 100.2,47.63 101.85,47.63 112.78,60.58 115.06,63.37 124.71,63.37 IC5.1
BB_TX
  Top 0.152: 132.33,63.88 IC5.4
  Top 0.254: 131.19,62.36 131.19,48.51 130.43,47.75 122.17,47.75 IC4.11
  Top 0.508: 131.19,62.36 132.33,63.88
  Bottom 0.254: IC4.11 117.86,45.85 100.2,45.85 99.19,44.83
  Bottom 0.508: 99.19,44.83 U$1.70
BOB1
  Top 0.254: K1.2 57.4,48.13 55.88,46.61 IC2.10
  Top 0.508: 55.88,46.61 53.34,46.61 IC2.11
BOB2
  Top 0.381: K2.2 39.12,55.75 39.12,52.32 43.05,48.39 47.5,48.39 48.39,47.5 48.39,46.61 IC2.13
  Top 0.508: IC2.12 50.8,46.61 48.26,46.61 IC2.13
BOB3
  Top 0.152: 43.18,46.61 IC2.15
  Top 0.508: 43.18,46.61 45.72,46.61 IC2.14
  Bottom 0.152: 20.83,58.04 K3.2
  Bottom 0.381: 43.18,46.61 37.72,52.07 37.59,52.2 35.43,52.2 32.77,49.53 32.77,49.02 32,48.26 22.86,48.26 20.83,50.29 20.83,58.04
  Bottom 0.508: 43.18,46.61 IC2.15
BOB4
  Bottom 0.152: 40.64,46.61 IC2.16 | 2.54,58.04 K4.2
  Bottom 0.381: 40.64,46.61 23.11,46.61 22.73,46.23 17.02,46.23 14.99,44.32 12.19,44.32 8,48.13 8,49.66 2.54,55.12 2.54,58.04
BOB5
  Top 0.254: 19.3,35.43 14.48,30.61 K5.2
  Top 0.508: IC3.11 21.84,35.69 19.3,35.69 IC3.10 19.3,35.43
BOB6
  Top 0.254: 32.77,33.53 32.77,33.78
  Top 0.406: K6.2 32.77,33.53 32.64,33.66 27.18,33.66 26.92,33.91 IC3.13
  Top 0.508: IC3.12 24.38,35.69 26.92,35.69 IC3.13
BOB7
  Top 0.508: IC3.14 29.46,35.69 32,35.69 IC3.15
  Bottom 0.152: 50.8,25.53 K7.2
  Bottom 0.381: 32,34.29 35.56,30.61 40.64,30.61 | 43.18,33.15 46.99,33.15 50.8,29.34 50.8,25.53
  Bottom 0.406: 43.18,33.15 40.64,30.61
  Bottom 0.508: 32,34.29 IC3.15
BOB8
  Bottom 0.152: 68.58,25.53 K8.2
  Bottom 0.381: IC3.16 39.5,35.56 40.51,34.54 59.94,34.54 60.45,34.8 68.89,34.8 68.9,34.78
  Bottom 0.406: 68.9,34.78 69.34,34.42 K8.2
GND
  Top 0.152: 132.33,71.25 IC5.5 | 121.67,33.91 OK2.11
  Top 0.254: 113.79,56.52 114.55,56.52 114.55,60.33 | U$1.1 141.22,16 141.22,19.18 OK2.9 | 120.9,46.74 120.9,52.71 | 16.76,43.31 18.67,45.21 36.07,45.21 | 89.66,19.18 89.66,26.29 JP1.1 | OK1.15 89.92,33.91 | 58.42,40.51 36.07,40.51 | 105.66,28.32 OK2.15 | J1.5 C3.2 61.59,42.55 63.63,44.58 63.63,47.37 64.26,48.01 69.34,48.01 72.39,51.05 72.64,51.05 74.17,52.58 | U$1.48 99.44,16 99.82,16.38 102.36,16.38
  Top 0.381: 102.36,16.38 105.66,19.69 | C2.2 95.38,17.27 U$1.47 | 114.55,56.52 114.68,56.52 116.33,54.86 118.75,54.86 120.9,52.71 | IC4.15 132.33,47.37 131.19,46.23 | 74.17,52.71 74.17,52.58 | U$1.90 U$1.89 U$1.91 U$1.92
  Top 0.406: 105.66,19.69 105.66,28.32
  Top 0.508: 121.67,46.23 131.19,46.23 | 121.67,33.91 121.67,46.23 | 121.67,46.23 120.9,46.74 | 16.76,43.31 IC3.8 | JP1.1 91.19,29.08 IC6.2 89.92,33.91 | OK1.9 74.17,52.71 | IC2.8 58.42,40.51
  Top 0.762: 114.55,60.33 C10.2 | U$1.48 U$1.47 | C6.2 36.07,45.21 36.07,40.51 C7.2 | 89.66,19.18 90.93,19.18 C2.2
  Top 1.016: 113.79,56.52 C5.2 | 89.66,19.18 IC1.2
  Bottom 0.152: 127.25,63.63 IC5.2 | 132.33,70.99 IC5.5 | 114.81,60.33 C10.2 | 13.72,42.04 C4.2 | 58.42,38.99 IC2.8 | 124.71,6.99 C1.2
  Bottom 0.254: 127.25,63.63 128.78,65.15 103.89,65.15 99.31,69.72 | 114.81,60.33 116.33,61.85 125.73,61.85 127.25,63.37 | OK2.15 112.39,32.77 115.57,32.77 | OK2.13 115.57,32.77 | 120.65,32.77 OK2.11 | 115.57,32.77 120.65,32.77 | OK2.9 125.98,32.77 120.65,32.77 | OK1.9 75.69,53.72 78.74,53.72 | OK1.11 78.74,53.72 | 83.82,53.72 OK1.13 | 78.74,53.72 83.82,53.72 | OK1.15 88.9,53.72 83.82,53.72
  Bottom 0.381: 124.84,6.73 C1.2 | 99.31,69.72 99.31,69.47 U$1.90
  Bottom 0.406: ALIM1.1 147.03,79.97 143.51,76.45 140.46,76.45 138.3,74.3 135.51,74.3 IC5.5
  Bottom 0.508: 128.78,65.15 133.1,69.47 133.1,70.99 132.84,70.99 | 132.33,70.99 132.84,70.99 | 132.84,70.99 IC5.5 | 127.25,63.37 IC5.2 | U$1.2 U$1.1 | 16.76,43.05 IC3.8 | 59.69,40.26 C3.2
  Bottom 0.762: 13.72,42.04 15.62,42.04 IC3.8 | 59.69,40.26 58.42,38.99
  Bottom 1.016: 124.84,6.73 137.79,6.73 139.06,5.46 139.06,3.09 ALIM.1 139.57,3.05 140.08,3.56 140.08,9.53 144.91,14.35 U$1.1
I2C1_SCL
  Top 0.152: 116.84,80.14 I2C.2
  Top 0.254: 116.84,80.14 116.84,67.56 107.82,67.56 102.36,62.1 102.36,38.61 101.35,37.59 98.55,37.59 97.79,36.7 96.9,36.7 U$1.63
  Bottom 0.254: U$1.63 96.14,36.2 91.19,36.2 88.65,38.74 74.93,38.74 73.15,40.51 73.15,43.69 72.64,44.2 70.87,44.2 68.33,41.66 J1.3
I2C1_SDA  (via drill 0.6)
  Top 0.152: 121.67,80.14 I2C.1
  Top 0.254: 121.67,80.14 121.67,66.55 107.82,66.55 102.87,61.6 102.87,37.34 101.85,36.32 U$1.64 | v70.48,39.88 69.6,39.88 J1.2
  Bottom 0.254: U$1.64 97.92,35.05 91.44,35.05 88.27,38.23 74.3,38.23 72.64,39.88 v70.48,39.88
I2C2_SCL
  Top 0.381: SCL2.TP 95.63,40.26 U$1.65
I2C2_SDA
  Top 0.381: SDA2.TP 95,38.23 95.63,37.59 97.41,37.59 98.93,39.12 99.06,39.12 U$1.66
IN1  (via drill 0.6)
  Top 0.381: v101.35,44.45 100.33,45.21 98.68,45.21 97.92,45.97 97.92,49.91 97.54,50.29 92.46,50.29
  Top 0.508: 91.19,48.9 R18.1
  Top 0.762: 91.19,48.9 92.46,50.17 92.46,50.29 OK1.16
  Bottom 0.381: U$1.15 139.06,33.78 136.65,31.37 109.47,31.37 105.79,35.05 105.79,40.01 v101.35,44.45
IN1_12V
  Top 0.508: R17.1 103.89,70.99 R1.2
  Bottom 0.254: R17.1 103.38,68.58 100.84,70.61 98.55,70.61 97.92,69.98 97.92,61.47 97.79,61.34 97.79,60.96 97.28,60.45 95.89,60.45 95.5,60.83 93.47,60.83 93.22,60.58 92.71,60.58 OK1.1
IN2
  Top 0.508: R19.1 87.38,49.4 OK1.14
  Bottom 0.254: 144.53,29.08 U$1.11
  Bottom 0.381: 108.71,29.08 100.08,37.59 95.38,37.59 94.74,36.96 91.44,36.96 89.15,39.24 75.69,39.24 73.91,41.02 73.91,47.88 76.07,50.04 85.72,50.04 R19.1
  Bottom 0.406: 108.71,29.08 144.53,29.08
IN2_12V
  Top 0.762: R2.2 R16.1
  Bottom 0.254: R16.1 109.35,68.58 105.16,72.77 103.89,72.77 103.5,72.39 101.6,72.39 101.47,72.52 101.35,72.52 99.82,74.04 95.63,74.04 94.87,73.28 94.87,71.37 87.38,63.88 OK1.3
IN3  (via drill 0.6)
  Top 0.381: v101.47,39.75 101.09,40.13 98.42,40.13 97.92,40.64 97.92,44.7 97.41,45.21 92.96,45.21 92.58,45.59 v91.82,45.59
  Top 0.508: OK1.12 R20.1
  Bottom 0.381: 147.32,31.62 U$1.14 146.18,32.51 144.27,32.51 143.89,32.89 141.99,32.89 139.7,30.61 109.22,30.61 104.78,35.05 104.78,36.45 v101.47,39.75 | v91.82,45.59 85.6,45.59 R20.1
IN3_12V
  Top 0.381: OK1.5 82.3,61.6
  Top 0.508: R3.2 R15.1 83.82,69.98 83.82,63.12 82.3,61.6
IN4
  Top 0.508: OK1.10 R21.1
  Bottom 0.381: U$1.12 147.32,29.08 146.43,29.97 143.26,29.97 143.13,29.85 109.09,29.85 100.46,38.48 100.46,40.13 95.38,40.13 94.49,39.24 90.81,39.24 90.04,40.01 86.11,40.01 85.22,40.89 85.22,42.04 82.55,44.7 81.03,44.7 R21.1
IN4_12V
  Top 0.254: 76.2,72.52 74.93,73.79
  Top 0.381: R14.1 76.2,71.37 77.72,69.85 77.72,60.83 OK1.7
  Top 0.762: R14.1 76.2,72.52 | 74.93,73.79 R4.2
IN5
  Top 0.152: 108.97,33.91 OK2.16 | 108.97,37.21 R22.1
  Top 0.508: 108.97,37.21 108.97,33.91
  Bottom 0.152: 147.32,34.16 U$1.16
  Bottom 0.381: OK2.16 110.24,32.13 133.48,32.13 136.4,35.05 146.18,35.05
  Bottom 0.508: 146.18,35.05 147.32,34.16
IN5_12V
  Top 0.381: 108.84,21.59 103.12,15.75 100.71,15.75 99.44,14.48 87.63,14.48 83.82,10.67 R5.2
  Top 0.406: OK2.1 108.84,21.59
  Top 0.508: R5.2 82.8,9.91 80.01,12.57 80.01,18.42 R13.1
IN6
  Top 0.152: 114.05,33.91 OK2.14 | 114.05,37.21 R23.1
  Top 0.508: 114.05,37.21 114.05,33.91
  Bottom 0.152: 114.05,37.21 R23.1
  Bottom 0.254: 114.05,37.21 115.06,36.2 144.27,36.2 144.78,36.7 U$1.17
IN6_12V
  Top 0.152: 93.47,12.07 R12.1 | 93.98,10.03 R6.2
  Top 0.254: 113.92,23.88 104.27,14.48 101.35,14.48 99.31,12.45 93.73,12.45 R12.1
  Top 0.381: 93.98,11.56 93.98,11.68 R12.1
  Top 0.406: OK2.3 113.92,23.88
  Top 0.508: 93.98,10.03 93.98,11.56
IN7
  Top 0.152: 119.13,33.91 OK2.12 | 119.13,37.21 R24.1
  Top 0.508: 119.13,37.21 119.13,33.91
  Bottom 0.152: 119.13,37.21 R24.1
  Bottom 0.254: 146.43,37.59 147.32,36.7 U$1.18 | 119.13,37.21 120.9,38.99
  Bottom 0.381: 146.43,37.59 137.41,37.59 137.29,37.47 130.3,37.47 128.78,38.99 120.78,38.99 R24.1
IN7_12V
  Top 0.406: OK2.5 119,23.24 116.71,21.21 113.67,21.21 108.46,15.75 108.46,14.86 106.55,12.95 R11.1 R7.2
IN8
  Top 0.152: 124.21,33.91 OK2.10 | 124.21,37.21 R25.1
  Top 0.381: 126.36,44.32 131.57,44.32 132.84,45.59 142.11,45.59 142.24,45.47 143.76,45.47 144.02,45.21 145.41,45.21 146.3,46.1 147.07,46.1 U$1.26
  Top 0.406: 124.21,33.91 124.21,37.21 125.48,38.48 125.48,43.43 126.36,44.32
IN8_12V
  Top 0.406: R10.1 114.3,12.57 124.08,22.35 124.08,25.02 124.21,25.15 124.21,26.04 OK2.7
  Top 0.508: R10.1 R8.2
N$1
  Top 0.152: 111.76,80.14 IN1.1
  Top 0.254: 111.76,80.14 111.76,71.25
  Top 0.508: 111.76,71.25 R1.1
N$2
  Bottom 0.152: 10.41,42.04 TP1.TP | 5.08,44.07 X10.1
  Bottom 0.508: 10.41,42.04 8.38,44.07 5.08,44.07
N$6
  Bottom 1.676: X5.1 2.54,3.03 K5.S
N$7
  Bottom 1.676: X5.2 K5.P
N$8
  Bottom 1.676: X5.3 14.48,3.03 K5.O
N$12
  Bottom 1.676: X6.1 20.83,3.03 K6.S
N$13
  Bottom 1.676: X6.2 27.05,3.03 27.05,27.56 26.8,27.56 K6.P
N$14
  Bottom 1.676: X6.3 32.77,3.03 K6.O
N$15
  Bottom 1.676: K3.S 31.8,70.36 X3.1
N$16
  Bottom 1.676: K3.P X3.2
N$17
  Bottom 1.676: K3.O 21.8,70.36 X3.3
N$18
  Bottom 0.152: 13.72,36.7 C4.1
  Bottom 0.508: 16.76,35.69 IC3.9
  Bottom 0.762: 16.76,35.69 15.75,36.7 13.72,36.7
N$19
  Bottom 0.406: X7.1 39.37,3.03
  Bottom 1.676: 39.37,3.03 K7.S
N$20
  Bottom 1.676: X7.2 K7.P
N$21
  Bottom 1.676: K4.S 13.51,70.36 X4.1
N$22
  Bottom 1.676: K4.P X4.2
N$23
  Bottom 1.676: K4.O 3.51,70.36 X4.3
N$24
  Bottom 1.676: X8.1 57.4,3.03 K8.S
N$25
  Bottom 1.676: X8.2 63.37,3.03 K8.P
N$26
  Bottom 1.676: X8.3 69.34,3.03 K8.O
N$27
  Top 0.152: 102.62,73.79 R2.1
  Top 0.406: 102.62,73.79 101.6,74.8 101.6,80.14
  Top 0.508: 101.6,80.14 IN2.1
N$28
  Bottom 0.152: 5.33,49.15 5.08,49.15 X10.2
  Bottom 0.508: 5.33,49.15 TP2.TP
N$29
  Top 0.508: R3.1 92.96,74.04 91.44,75.57 91.44,80.14 IN3.1
N$30
  Top 0.152: 5.08,34.16 X11.1
  Top 0.508: 5.08,34.16 TP3.TP
N$31
  Top 0.152: 82.55,74.04 R4.1 | 81.28,80.14 IN4.1
  Top 0.508: 82.55,74.04 81.28,75.31 81.28,80.14
N$32
  Top 0.152: 10.41,39.24 TP4.TP | 5.08,39.24 X11.2
  Top 0.508: 5.08,39.24 10.41,39.24
N$33
  Top 0.152: 76.2,3.18 IN5.1
  Top 0.762: 76.2,3.18 R5.1
N$34
  Bottom 0.152: 143.26,25.91 TP7.TP | 147.32,24 U$1.8
  Bottom 0.508: 143.26,25.91 144.27,24.89 146.43,24.89 147.32,24
N$35
  Bottom 0.406: IN6.1 86.4,9.82 R6.1
N$36
  Top 0.508: U$1.45 TP22.TP
N$37
  Bottom 0.406: IN7.1 96.56,9.82 R7.1
N$38
  Top 0.508: U$1.43 TP20.TP
N$39
  Bottom 0.406: IN8.1 106.72,9.87 R8.1
N$40
  Top 0.508: U$1.41 TP19.TP
N$41
  Top 0.406: IN8.2 111.72,3.52 113.54,5.33 121.28,5.33 122.05,6.1 122.05,15.62 126.62,20.19 OK2.8
N$42
  Top 0.406: IN7.2 101.56,5.42 102.62,6.48 107.31,6.48 110.49,9.65 110.49,12.95 111.51,13.97 113.03,13.97 121.28,22.23 121.28,25.91 OK2.6
N$43
  Top 0.254: 115.19,23.88 105.28,13.97 102.23,13.97 99.69,11.43 99.69,9.14 97.16,6.6 92.71,6.6 91.4,5.29 IN6.2
  Top 0.406: OK2.4 116.46,24.77 115.57,23.88 115.19,23.88
N$44
  Top 0.381: 111.38,22.61 103.63,15.11 100.97,15.11 99.44,13.59 91.31,13.59 88.77,11.05 88.77,8.26 87.38,6.86 83.57,6.86 81.24,4.53 IN5.2
  Top 0.406: OK2.2 111.38,22.61
N$45
  Top 0.254: IN1.2 106.72,75.73 103.5,72.52 101.35,72.52 99.82,74.04 96.01,74.04 95.12,73.15 95.12,70.49 89.92,65.28 89.92,61.6 90.04,61.47 90.04,60.45 OK1.2
N$46
  Top 0.152: 96.52,80.14 IN2.2
  Top 0.254: OK1.4 86.36,61.85 86.36,65.91 94.74,74.3 94.74,78.36 96.52,80.14
N$47
  Top 0.152: 86.36,80.14 IN3.2
  Top 0.381: 81.28,71.25 81.28,71.37 82.42,72.52 83.44,72.52 83.95,73.03 83.95,74.93 84.71,75.69 85.34,75.69 86.36,76.71 | OK1.6 79.76,61.72
  Top 0.508: 81.28,71.25 81.28,63.25 79.76,61.72 | 86.36,80.14 86.36,76.71
N$48
  Top 0.152: 76.33,80.14 IN4.2
  Top 0.508: OK1.8 73.28,61.09 73.28,77.85 76.33,80.14
N$49
  Top 0.381: JP1.2 U$1.55
N$50
  Top 0.508: U$1.39 TP18.TP
N$51
  Top 0.508: U$1.37 TP17.TP
N$52
  Top 0.508: U$1.35 TP16.TP
N$53
  Top 0.508: U$1.33 TP15.TP
N$54
  Top 0.508: U$1.31 TP14.TP
N$55
  Top 0.508: U$1.29 TP13.TP
N$56
  Top 0.508: U$1.27 TP12.TP
N$57
  Top 0.152: 143.26,46.86 TP11.TP
  Top 0.508: U$1.25 143.26,46.86
N$58
  Top 0.508: U$1.23 TP10.TP
N$59
  Top 0.508: U$1.21 TP9.TP
N$60
  Top 0.508: U$1.19 TP21.TP
N$61
  Top 0.508: U$1.3 TP5.TP
N$62
  Top 0.508: U$1.5 TP6.TP
N$63
  Bottom 0.406: X7.3 51.31,3.03
  Bottom 1.676: 51.31,3.03 K7.O
N$64
  Top 0.508: U$1.13 TP8.TP
N$65
  Bottom 0.254: TP33.TP U$1.85
N$66
  Top 0.254: TP32.TP U$1.83
N$67
  Top 0.254: TP31.TP U$1.81
N$68
  Top 0.254: TP30.TP U$1.79
N$69
  Top 0.254: TP29.TP U$1.77
N$70
  Top 0.254: TP28.TP U$1.75
N$71
  Bottom 0.381: TP27.TP U$1.71
N$72
  Top 0.381: TP26.TP 96.27,42.16 U$1.67
N$73
  Bottom 0.381: TP25.TP U$1.59
N$74
  Bottom 0.381: TP24.TP U$1.57
N$75
  Top 0.381: TP23.TP U$1.53
N$76
  Top 0.508: U$1.54 TP34.TP
N$77
  Top 0.508: U$1.56 TP35.TP
N$78
  Top 0.508: U$1.60 TP36.TP
N$79
  Top 0.508: U$1.62 TP37.TP
N$80
  Top 0.508: U$1.68 TP38.TP
N$81
  Top 0.508: U$1.74 TP39.TP
N$82
  Top 0.508: U$1.76 TP40.TP
N$83
  Top 0.508: U$1.78 TP41.TP
N$84
  Top 0.508: U$1.80 TP42.TP
N$85
  Top 0.508: U$1.82 TP43.TP
N$86
  Top 0.508: U$1.84 TP44.TP
N$87
  Top 0.508: U$1.86 TP45.TP
N$88
  Top 0.508: U$1.46 TP61.TP
N$89
  Top 0.508: U$1.44 TP60.TP
N$90
  Top 0.508: U$1.42 TP59.TP
N$91
  Top 0.508: U$1.40 TP58.TP
N$92
  Top 0.508: U$1.38 TP57.TP
N$93
  Top 0.508: U$1.36 TP56.TP
N$94
  Top 0.508: U$1.34 TP55.TP
N$95
  Top 0.508: U$1.32 TP54.TP
N$96
  Top 0.508: U$1.30 TP53.TP
N$98
  Top 0.508: U$1.24 TP51.TP
N$99
  Top 0.508: U$1.22 TP50.TP
N$100
  Top 0.508: U$1.20 TP49.TP
N$101
  Top 0.508: U$1.10 TP48.TP
N$102
  Top 0.508: U$1.6 TP47.TP
N$103
  Top 0.508: U$1.4 TP46.TP
N$105
  Bottom 0.508: C8.1 IC4.1
N$106
  Bottom 0.508: IC4.3 134.87,52.71 C8.2
N$107
  Top 0.508: C9.1 IC4.4
N$108
  Bottom 0.254: C9.2 IC4.5
R1_C
  Bottom 1.676: X1.2 K1.P
R1_NA
  Bottom 1.676: X1.1 69.34,80.16 K1.S
R1_NC
  Bottom 1.676: X1.3 57.4,80.16 K1.O
R2_C
  Bottom 1.676: K2.P X2.2
R2_NA
  Bottom 0.254: 50.93,70.36 K2.S
  Bottom 1.676: 50.93,70.36 50.93,80.26 50.09,80.26 X2.1
R2_NC
  Bottom 1.676: K2.O 40.09,70.36 X2.3
REL1
  Top 0.508: IC2.6 53.34,38.99 55.88,38.99 IC2.7
  Bottom 0.254: IC2.7 55.63,38.61 55.63,38.35 57.15,36.83 62.48,36.83 63.75,38.1 67.06,38.1 68.33,36.83 87.63,36.83 92.2,32.26 92.2,30.73 92.58,30.35 95.38,30.35 95.76,29.97 97.92,29.97 U$1.58
REL2
  Top 0.152: 50.8,38.99 IC2.5
  Top 0.508: 50.8,38.99 48.26,38.99 IC2.4
  Bottom 0.254: 91.69,33.78 88.01,37.47 69.47,37.47 66.8,40.13 63.63,40.13 62.23,41.53 51.94,41.53
  Bottom 0.381: U$1.61 91.69,33.78 | 51.94,41.53 50.8,40.39 IC2.5
REL3  (via drill 0.6)
  Top 0.152: 45.72,38.99 IC2.3
  Top 0.381: v71.12,42.93 v88.65,42.93
  Top 0.508: 45.72,38.99 43.18,38.99 IC2.2
  Bottom 0.254: 47.88,42.29 62.61,42.29 64.26,40.64 68.83,40.64 70.48,42.29
  Bottom 0.381: IC2.3 45.72,40.13 47.88,42.29 | v88.65,42.93 90.81,42.93 91.82,43.94 U$1.69 | 70.48,42.29 v71.12,42.93
REL4
  Bottom 0.254: 42.93,36.07 62.87,36.07 64.39,37.59 66.55,37.59 67.94,36.2 71.63,36.2 71.75,36.07
  Bottom 0.381: U$1.9 144.91,26.67 143.64,27.94 129.03,27.94 128.65,28.32 106.68,28.32 103.89,25.53 103.89,24.77 101.09,21.97 101.09,17.91 100.46,17.27 96.27,17.27 95.5,18.03 95.5,21.46 94.74,22.23 93.98,22.23 90.55,25.65 90.55,32.77 89.92,33.4 74.42,33.4 71.75,36.07 | 42.93,36.07 40.77,38.23 40.77,38.74 IC2.1
REL5
  Top 0.254: 21.84,43.31 21.97,43.31 22.1,43.43 21.97,43.43 21.72,43.18 21.97,43.18
  Top 0.508: IC3.7 19.3,43.31 21.84,43.31 IC3.6
  Bottom 0.254: U$1.73 92.71,49.4 92.08,50.04 91.69,50.04 91.19,50.55 91.19,54.48 90.68,54.99 74.04,54.99 72.26,53.21 72.26,49.4 68.07,45.21 64.39,45.21 63.25,44.07 38.73,44.07 37.08,45.72 23.24,45.72 22.1,44.58 22.1,43.43 IC3.6
REL6  (via drill 0.6)  (1 unrouted)
  Top 0.254: v71.75,45.85 77.34,45.85 81.03,49.53 81.03,55.88 82.42,57.28 91.57,57.28 93.73,59.44 93.73,62.87 95.25,64.39 95.25,65.53 96.65,66.93 U$1.87
  Top 0.381: 24.38,43.31 26.8,43.31 IC3.4
  Top 0.508: 24.38,43.31 IC3.5
  Bottom 0.254: 26.92,43.31 28.7,45.09 33.02,45.09 33.27,44.83 33.27,41.91 33.78,41.4 40.89,41.4 42.42,42.93 63.63,42.93 63.88,42.67 68.58,42.67 v71.75,45.85
REL7
  Top 0.254: 29.46,43.31 IC3.3 | 32,43.31 IC3.2
  Top 0.508: 32,43.31 29.46,43.31
  Bottom 0.254: 144.53,24 U$1.7
  Bottom 0.381: 131.44,24 127.76,27.69 107.19,27.69 104.65,25.15 104.65,24.38 102.11,21.84 102.11,16.38 100.46,14.73 95.5,14.73 94.87,15.37 94.87,20.96 94.36,21.46 93.22,21.46 92.2,22.48 92.2,23.11 89.92,25.4 89.92,30.61 89.53,30.99 74.55,30.99 70.1,35.43 41.02,35.43 37.34,39.12 35.18,39.12 32,42.29 IC3.2
  Bottom 0.406: 131.44,24 144.53,24
REL8  (via drill 0.6)
  Top 0.254: v72.26,47.75 73.66,47.75 75.95,50.04 75.95,55.37 78.87,58.29 89.79,58.29 91.19,59.69 91.19,64.9 94.36,68.07 97.92,68.07 U$1.88
  Bottom 0.254: IC3.1 34.92,43.18 35.31,43.56 64.01,43.56 64.39,43.18 67.82,43.18 69.09,44.45 69.09,45.09 71.75,47.75 v72.26,47.75
RS485_ENABLE
  Top 0.508: IC5.3 TP62.TP
  Bottom 0.381: TP52.TP U$1.28 | U$1.28 147.32,49.4 | IC5.3 129.92,63.63 129.92,64.39 130.94,65.41 136.65,65.41 140.34,61.72 140.34,52.58 142.24,50.67 143.89,50.67 144.02,50.55 144.15,50.55 144.4,50.29 146.43,50.29 147.19,49.53 147.19,49.28 U$1.28
RX_B
  Top 0.152: 127.25,70.99 IC5.7 | 125.48,73.79 R9.2 | 126.75,80.14 X9.3
  Top 0.254: IC4.13 125.98,51.44 125.98,69.72 127.25,70.99
  Top 0.508: 125.48,73.79 127.25,72.01 IC5.7 | 126.75,80.14 125.48,78.87 R9.2
TX_A
  Top 0.152: 129.79,70.99 IC5.6 | 132.08,80.14 X9.2
  Top 0.254: IC4.14 128.78,51.18 128.78,69.98 129.79,70.99 | 133.1,73.79 R9.1
  Top 0.508: 132.08,73.79 129.79,73.79 IC5.6 | 132.08,73.79 133.1,73.79 | 132.08,73.79 132.08,80.14
V+
  Top 0.508: C11.2 IC4.2
V-
  Top 0.254: IC4.6 119.89,60.07 119.89,60.33 C10.1

### Text on the board
tPlace: P9 | P8
_tsilk: N.C. | C4 | N.A. | N.C. | C3 | N.A. | N.C. | C2 | N.A. | N.C. | C1 | N.A. | K | A | K | A | K | A | K | A | B | A | 5V | 12V | GND | Osso v2.0 by / http://www.unixmedia.net | N.A. | C5 | N.C. | N.A. | C6 | N.C. | N.A. | C7 | N.C. | N.A. | C8 | N.C. | A | K | A | K | A | K | A | K | GND | 12V